# EAGLE design Palette PCB (EAGLE 7.6.0)
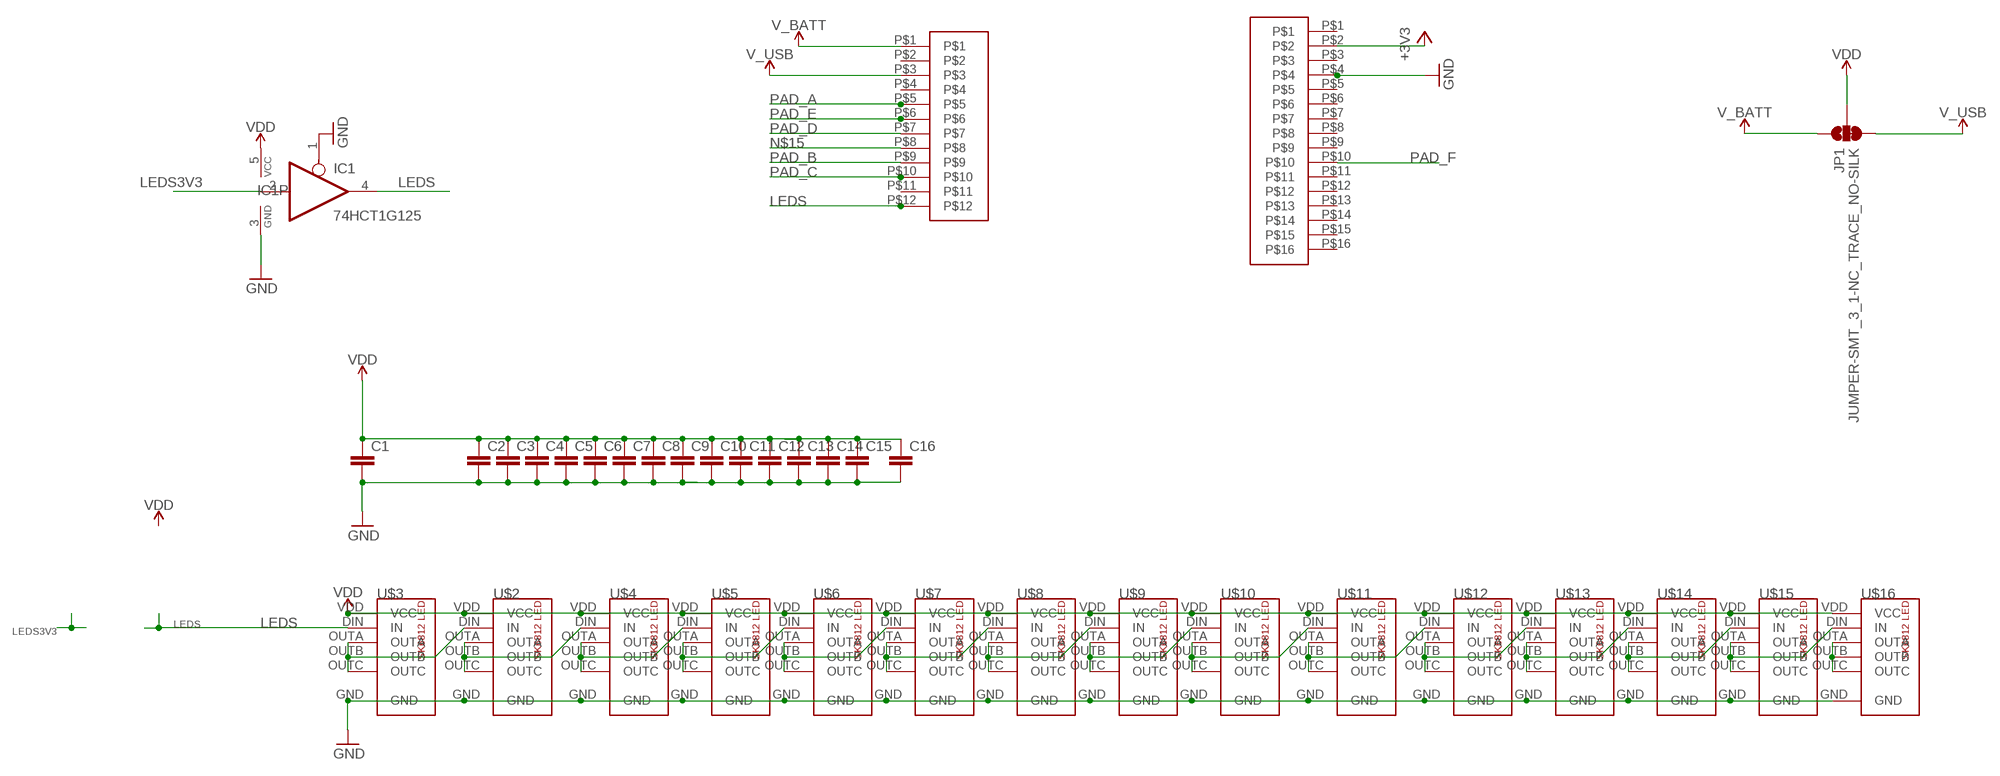
[diagram p0: schematic, sheet 1]

## Parts
C1  C-EUC0402K  [C0402K]
C2  C-EUC0402K  [C0402K]
C3  C-EUC0402K  [C0402K]
C4  C-EUC0402K  [C0402K]
C5  C-EUC0402K  [C0402K]
C6  C-EUC0402K  [C0402K]
C7  C-EUC0402K  [C0402K]
C8  C-EUC0402K  [C0402K]
C9  C-EUC0402K  [C0402K]
C10  C-EUC0402K  [C0402K]
C11  C-EUC0402K  [C0402K]
C12  C-EUC0402K  [C0402K]
C13  C-EUC0402K  [C0402K]
C14  C-EUC0402K  [C0402K]
C15  C-EUC0402K  [C0402K]
C16  C-EUC0805K  [C0805K]
IC1  74HCT1G125  74AHC1G125DBV  [SOT23-5]
JP1  JUMPER-SMT_3_1-NC_TRACE_NO-SILK  [SMT-JUMPER_3_1-NC_TRACE_NO-SILK]
U$2  SK6812OK  [SK6812_V2C]
U$3  SK6812OK  [SK6812_V2C]
U$4  SK6812OK  [SK6812_V2C]
U$5  SK6812OK  [SK6812_V2C]
U$6  SK6812OK  [SK6812_V2C]
U$7  SK6812OK  [SK6812_V2C]
U$8  SK6812OK  [SK6812_V2C]
U$9  SK6812OK  [SK6812_V2C]
U$10  SK6812OK  [SK6812_V2C]
U$11  SK6812OK  [SK6812_V2C]
U$12  SK6812OK  [SK6812_V2C]
U$13  SK6812OK  [SK6812_V2C]
U$14  SK6812OK  [SK6812_V2C]
U$15  SK6812OK  [SK6812_V2C]
U$16  SK6812OK  [SK6812_V2C]
U$17  SMD-FEMALE-HEADER-16  [SMD-FEMALE-HEADER-16]
U$18  SMD-FEMALE-HEADER-12  [SMD-FEMALE-HEADER-12]

## Nets
+3V3: U$17.P$2
GND: C1.2 C2.2 C3.2 C4.2 C5.2 C6.2 C7.2 C8.2 C9.2 C10.2 C11.2 C12.2 C13.2 C14.2 C15.2 C16.2 IC1.1(OE) IC1.3(GND) U$2.GND U$3.GND U$4.GND U$5.GND U$6.GND U$7.GND U$8.GND U$9.GND U$10.GND U$11.GND U$12.GND U$13.GND U$14.GND U$15.GND U$16.GND U$17.P$4
LEDS: IC1.4(O) U$3.DIN(IN) U$18.P$12
LEDS3V3: IC1.2(I)
N$2: U$2.DIN(IN) U$3.OUTA U$3.OUTB U$3.OUTC
N$3: U$2.OUTA U$2.OUTB U$2.OUTC U$4.DIN(IN)
N$4: U$4.OUTA U$4.OUTB U$4.OUTC U$5.DIN(IN)
N$5: U$5.OUTA U$5.OUTB U$5.OUTC U$6.DIN(IN)
N$6: U$6.OUTA U$6.OUTB U$6.OUTC U$7.DIN(IN)
N$7: U$7.OUTA U$7.OUTB U$7.OUTC U$8.DIN(IN)
N$8: U$8.OUTA U$8.OUTB U$8.OUTC U$9.DIN(IN)
N$9: U$9.OUTA U$9.OUTB U$9.OUTC U$10.DIN(IN)
N$10: U$10.OUTA U$10.OUTB U$10.OUTC U$11.DIN(IN)
N$11: U$11.OUTA U$11.OUTB U$11.OUTC U$12.DIN(IN)
N$12: U$12.OUTA U$12.OUTB U$12.OUTC U$13.DIN(IN)
N$13: U$13.OUTA U$13.OUTB U$13.OUTC U$14.DIN(IN)
N$14: U$14.OUTA U$14.OUTB U$14.OUTC U$15.DIN(IN)
N$15: U$18.P$8
N$16: U$15.OUTA U$15.OUTB U$15.OUTC U$16.DIN(IN)
N$18: U$16.OUTA U$16.OUTB U$16.OUTC
PAD_A: U$18.P$5
PAD_B: U$18.P$9
PAD_C: U$18.P$10
PAD_D: U$18.P$7
PAD_E: U$18.P$6
PAD_F: U$17.P$10
V_BATT: JP1.1 U$18.P$1
V_USB: JP1.3 U$18.P$3
VDD: C1.1 C2.1 C3.1 C4.1 C5.1 C6.1 C7.1 C8.1 C9.1 C10.1 C11.1 C12.1 C13.1 C14.1 C15.1 C16.1 IC1.5(VCC) JP1.2 U$2.VDD(VCC) U$3.VDD(VCC) U$4.VDD(VCC) U$5.VDD(VCC) U$6.VDD(VCC) U$7.VDD(VCC) U$8.VDD(VCC) U$9.VDD(VCC) U$10.VDD(VCC) U$11.VDD(VCC) U$12.VDD(VCC) U$13.VDD(VCC) U$14.VDD(VCC) U$15.VDD(VCC) U$16.VDD(VCC)
Unconnected: U$17.P$1 U$17.P$3 U$17.P$5 U$17.P$6 U$17.P$7 U$17.P$8 U$17.P$9 U$17.P$11 U$17.P$12 U$17.P$13 U$17.P$14 U$17.P$15 U$17.P$16 U$18.P$2 U$18.P$4 U$18.P$11

## Library data of the parts
C1-C16 = rcl:C-EU: CAPACITOR, European symbol
IC1 = 74xx-little-us:74*1G125: Single Bus Buffer Gate with 3-State Output
JP1 = SparkFun-Jumpers:JUMPER-SMT_3_1-NC_TRACE: Normally closed trace jumper (1 of 2 connections) This jumper has a trace between two pads so it's normally closed (NC). The other connection is normally open (NO). Use a razor knife to open the connection. For best results follow the IPC guidelines for cutting traces: Cutout at least 0.063 mm (0.005 in). Remove all loose material to clean up the cut area. Seal the cut with an approved epoxy. Reapply solder to reclose the connection, or to close the NO connection.
U$2-U$16 = Palette Eagle library:SK6812
U$17 = Palette Eagle library:SMD-FEMALE-HEADER-16
U$18 = Palette Eagle library:SMD-FEMALE-HEADER-12

## Net classes
3 VCC: width 0.254 mm, drill 0.406 mm, clearance 0.127 mm

## Board
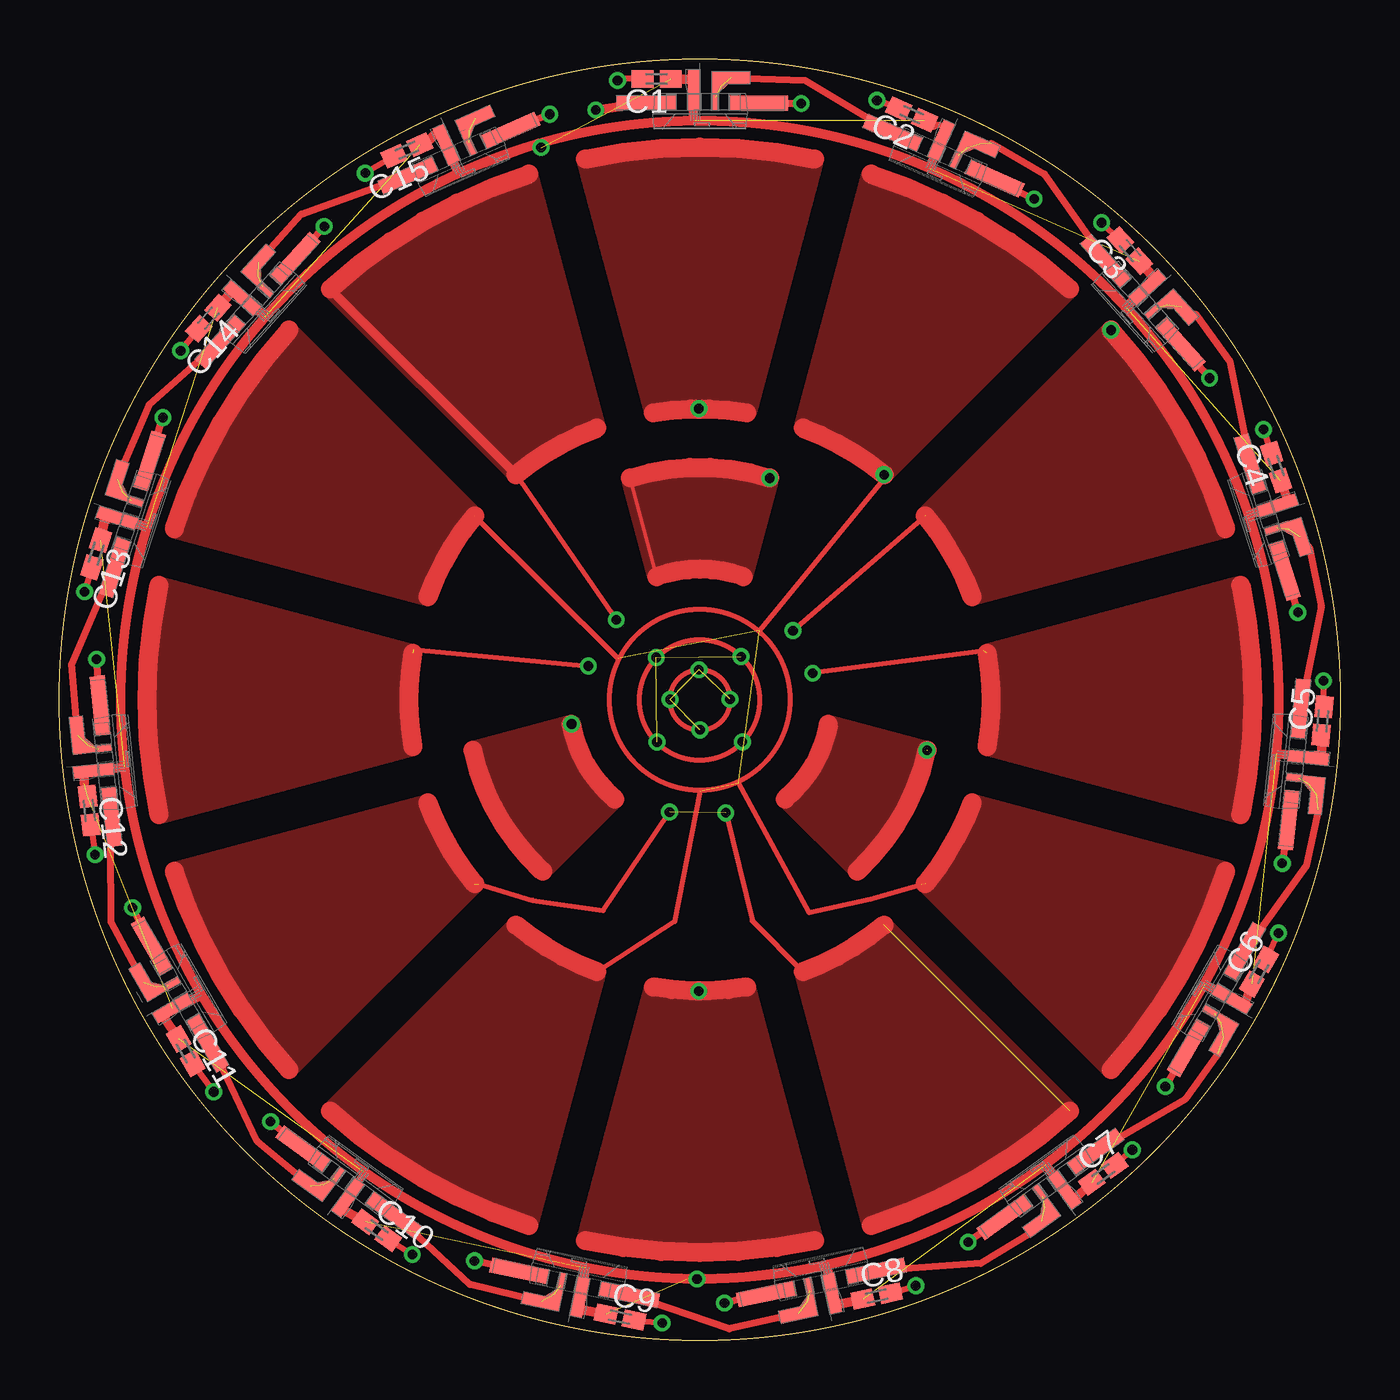
[diagram p1: board, top side]
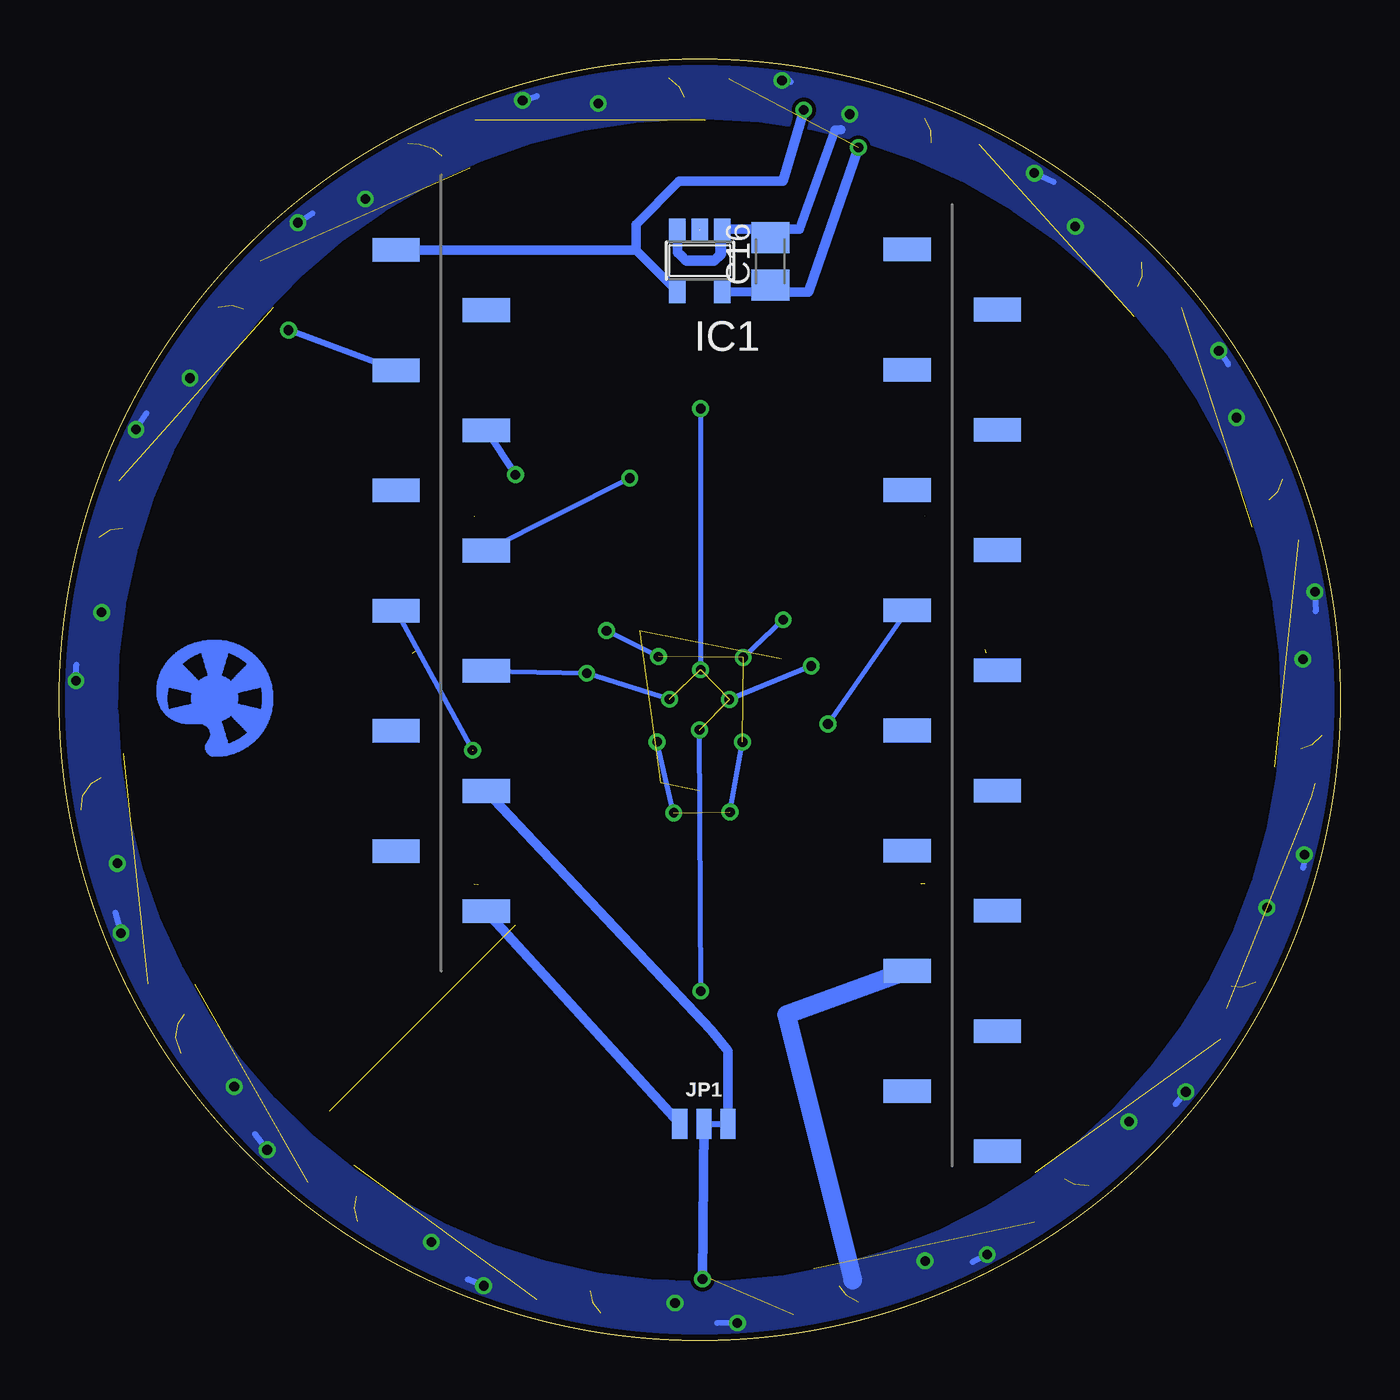
[diagram p2: board, bottom side, seen from below]

Size 54.14 x 54.14 mm. Coordinates in mm from the lower left corner, seen from the top.
Outline: circle at 27.07,27.07 radius 27.07
Copper layers (1*16): Top 0.035mm / dielectric 1.5mm / Bottom 0.035mm
Design rules "SeeedStudio_2layer_DRU_no_angle_20140221": minimum track width 6mil, minimum drill 12mil, track to track 6mil, track to pad 6mil, pad to pad 6mil, via to via 6mil, smd to smd 0mil, copper to edge 10mil, drill to drill 10mil, minimum pad ring 10mil, minimum via ring 6mil, stop-mask expansion 2mil, vias tented up to drill 100mil, thermal gap 10mil

### Footprints (pad centres in the part's own frame; a part is rotated, then mirrored left to right if it is on the bottom)
C0402K = smd 0.925 x 0.74: 1 -0.6,0; 2 0.6,0
C0805K = smd 1.3 x 1.6: 1 -1,0; 2 1,0
SOT23-5 = smd 0.69 x 0.99: 1 -0.95,-1.29; 2 0,-1.29; 3 0.95,-1.29; 4 0.95,1.3; 5 -0.95,1.3
SMT-JUMPER_3_1-NC_TRACE_NO-SILK = smd 0.635 x 1.27: 1 -1.016,0; 2 0,0; 3 1.016,0
SK6812_V2C = smd 2.5 x 0.635: DIN -2.295,1.271; GND 2.446,1.254 | smd 0.3 x 1.1: OUTA 0.633,1.508 | smd 0.6 x 0.3 rotated 45: OUTB 0.842,1.951 | smd 1.6 x 0.55: OUTC 1.291,2.334 | smd 0.5 x 1.7: VDD -0.278,1.811
SMD-FEMALE-HEADER-16 = smd 1 x 2: P$1 -2.54,-1.27; P$2 0,2.54; P$3 2.54,-1.27; P$4 5.08,2.54; P$5 7.62,-1.27; P$6 10.16,2.54; P$7 12.7,-1.27; P$8 15.24,2.54; P$9 17.78,-1.27; P$10 20.32,2.54; P$11 22.86,-1.27; P$12 25.4,2.54; P$13 27.94,-1.27; P$14 30.48,2.54; P$15 33.02,-1.27; P$16 35.56,2.54
SMD-FEMALE-HEADER-12 = smd 1 x 2: P$1 -2.54,-1.27; P$2 0,2.54; P$3 2.54,-1.27; P$4 5.08,2.54; P$5 7.62,-1.27; P$6 10.16,2.54; P$7 12.7,-1.27; P$8 15.24,2.54; P$9 17.78,-1.27; P$10 20.32,2.54; P$11 22.86,-1.27; P$12 25.4,2.54

### Placement (x,y rotation side)
C1  25.24,53.3 180 top
C2  36.02,51.79 156 top
C3  45.24,46.04 132 top
C4  51.42,36.9 108 top
C5  53.38,26.17 84 top
C6  50.7,15.58 60 top
C7  44.12,7.03 36 top
C8  34.54,1.87 12 top
C9  23.7,0.98 348 top
C10  13.42,4.65 324 top
C11  5.35,12.22 300 top
C12  1.27,22.38 276 top
C13  1.57,33.24 252 top
C14  6.3,43.19 228 top
C15  14.69,50.29 204 top
C16  24.08,45.59 90 bottom
IC1  27.06,45.62 180 bottom
JP1  26.9,9.14 0 bottom
U$2  36.78,48.94 336 top
U$3  27.09,51.02 0 top
U$4  44.81,43.06 312 top
U$5  49.83,34.46 288 top
U$6  50.95,24.55 264 top
U$7  47.85,15.1 240 top
U$8  41.19,7.67 216 top
U$9  32.01,3.7 192 top
U$10  22.12,3.65 168 top
U$11  13.04,7.67 144 top
U$12  6.23,15.18 120 top
U$13  3.24,24.53 96 top
U$14  4.26,34.45 72 top
U$15  9.27,43.04 48 top
U$16  17.34,48.98 24 top
U$17  15.76,10.53 90 bottom
U$18  37.36,20.67 90 bottom

### Tracks (layer width: path | path; a pad name or v marks a point on that pad's centre or on a via)
GND  (via drill 0.41)
  Top 0.254: C1.2 23.66,53.3 v23.59,53.23 | C2.2 v34.55,52.4 | C3.2 v44.05,47.23 | C4.2 v50.89,38.49 | C5.2 v53.42,27.87 | C6.2 v51.52,17.21 | C7.2 v45.35,8.05 | C8.2 v36.2,2.3 | C9.2 v25.48,0.73 | C10.2 v14.93,3.62 | C11.2 v6.53,10.5 | C12.2 v1.52,20.52 | C13.2 v1.07,31.63 | C14.2 v5.13,41.81 | C15.2 v12.94,49.32
  Top 0.305: U$3.GND v31.35,52.26 | U$2.GND v41.2,48.23 | U$4.GND v48.61,40.66 | U$5.GND v52.34,30.76 | U$6.GND v51.68,20.16 | U$7.GND v46.74,10.72 | U$8.GND v38.41,4.16 | U$9.GND v28.11,1.58 | U$10.GND v17.55,3.36 | U$11.GND v8.93,9.24 | U$12.GND v3.1,18.28 | U$13.GND v1.58,28.78 | U$14.GND v4.38,38.99 | U$15.GND v11.2,47.07 | U$16.GND v20.73,51.81
  Bottom 0.254: v23.59,53.23 23.27,53.23 23.21,53.18 | v34.55,52.4 33.95,52.57 | v44.05,47.23 43.44,47.62 | v50.89,38.49 50.44,39.18 | v53.42,27.87 53.41,28.56 | v51.52,17.21 51.75,18.07 | v45.35,8.05 45.86,8.71 | v36.2,2.3 36.87,2.58 | v25.48,0.73 26.32,0.72 | v14.93,3.62 15.54,3.32 | v6.53,10.5 6.97,9.97 | v1.52,20.52 1.58,19.97 | v1.07,31.63 1.05,30.81 | v5.13,41.81 4.74,41.24 | v12.94,49.32 12.11,48.94
  Bottom 0.406: IC1.3 28.01,45.98 27.63,45.6 26.46,45.6 26.15,45.9 26.15,46.87 IC1.1 | IC1.3 28.01,45.97 27.91,45.87 27.89,45.87 27.64,45.63 27.08,45.63 27.05,45.6 | IC1.3 28.01,45.96 27.69,45.64 26.46,45.64 26.2,45.9 26.2,46.6 26,46.81 26,46.95 24.18,46.95 | 24.18,46.95 22.86,46.95 21.35,51.14 21.11,51.15 | C16.2 24.18,46.95
  Bottom 0.813: U$17.P$4 23.4,13.76 20.6,2.55
  pour Bottom: -0.99,27.15 -0.97,27.17 arc-90 27.01,54.8 27.19,54.86 arc-90 54.86,26.18 arc-90 27.22,-0.76 27.2,-0.77 arc-90
LEDS  (via drill 0.41)
  Top 0.406: U$3.DIN v22.67,51.99
  Bottom 0.406: U$18.P$12 29.76,46.07 | 29.76,46.07 IC1.4 | 29.76,46.07 29.76,46.08 29.76,47.15 27.94,48.97 25.79,48.97 23.55,48.99 v22.67,51.99
N$2  (2 unrouted)
  Top 0.305: U$3.OUTC 31.52,53.24 U$2.DIN
N$3  (3 unrouted)
  Top 0.305: 39.38,50.58 41.63,49.28 U$4.DIN
N$4  (2 unrouted)
  Top 0.305: U$4.OUTC 48.03,43.35 49.47,41.36 U$5.DIN
N$5  (2 unrouted)
  Top 0.305: U$5.OUTC 52.82,33.51 53.33,31.01 U$6.DIN
N$6  (3 unrouted)
  Top 0.305: 53.2,22.4 52.71,20.06 U$7.DIN
N$7  (3 unrouted)
  Top 0.305: 48.98,12.12 47.58,10.19 U$8.DIN
N$8  (2 unrouted)
  Top 0.305: U$8.OUTC 41.04,4.51 38.94,3.25 U$9.DIN
N$9  (2 unrouted)
  Top 0.305: U$9.OUTC 28.3,0.48 U$10.DIN
N$10  (2 unrouted)
  Top 0.305: U$10.OUTC 17.35,2.36 14.92,4.62 U$11.DIN
N$11  (2 unrouted)
  Top 0.305: U$11.OUTC 8.37,8.41 6.91,11.49 U$12.DIN
N$12  (2 unrouted)
  Top 0.305: U$12.OUTC 2.19,17.67 2.18,20.92 U$13.DIN
N$13  (2 unrouted)
  Top 0.305: U$13.OUTC 0.53,28.57 1.8,31.53 U$14.DIN
N$14  (2 unrouted)
  Top 0.305: U$14.OUTC 3.79,39.53 U$15.DIN
N$16  (2 unrouted)
  Top 0.305: U$15.OUTC 10.23,47.59 U$16.DIN
N$18  (2 unrouted)
N$31
  cutout Bottom: 2.58,26.14 2.56,26.72 arc-90 26.84,51.54 27.47,51.53 arc-90 51.6,26.69 51.58,26.66 arc-90 26.86,2.57 28.05,2.58 arc-90
PAD_A  (via drill 0.41)  (5 unrouted)
  Top 0.203: 14.99,29.18 v22.36,28.5 | 39.07,29.13 v31.84,28.19
  Top 0.813: 22.23,49.91 arc-24 31.93,49.91 | 25.1,39.19 arc-19 29.05,39.19 | 49.93,31.91 arc-24 49.93,22.21 | 39.21,29.04 arc-19 39.21,25.09 | 31.93,4.21 arc-24 22.23,4.21 | 29.05,14.93 arc-19 25.1,14.93 | 4.22,22.21 arc-24 4.22,31.91 | 14.95,25.09 arc-19 14.95,29.04
  Bottom 0.203: v27.02,14.76 v27.08,25.79 | v22.36,28.5 v25.82,27.08 | v27.03,39.37 v27.03,28.34 | v28.35,27.09 v31.84,28.19 U$18.P$5
  pour Top: 22.05,49.87 26.73,50.61 32.13,49.89 29.26,39.17 27.04,39.57 24.94,39.1
  pour Top: 39.16,29.24 39.51,27.15 39.16,24.89 49.91,22.01 50.58,27.2 49.91,32.12
  pour Top: 32.12,4.22 26.95,3.56 22.04,4.24 24.92,14.98 27.03,14.63 29.24,14.96
  pour Top: 4.24,32.09 14.98,29.22 14.59,27.07 15.03,24.9 4.26,22.02 3.53,27.16
PAD_B  (via drill 0.41)  (5 unrouted)
  Top 0.203: 28.7,23.54 31.69,18.07 34.28,18.65 36.44,19.27 | 17.56,34.84 23.61,28.81 | 34.86,36.44 29.59,29.99 | 27.07,23.22 26,17.69 22.72,15.57
  Top 0.305: v34.85,36.58 34.27,37.21
  Top 0.406: v34.85,36.58 34.86,36.44
  Top 0.813: 34.31,49.28 arc-24 42.7,44.43 | 31.43,38.55 arc-19 v34.85,36.58 | 49.29,19.83 arc-24 44.44,11.44 | 38.57,22.71 arc-19 36.6,19.29 | 19.85,4.85 arc-24 11.45,9.69 | 22.72,15.57 arc-19 19.3,17.54 | 4.86,34.29 arc-24 9.71,42.69 | 15.58,31.42 arc-19 17.56,34.84
  Bottom 0.305: U$18.P$9 v34.85,36.58
  pour Top: 31.24,38.61 33.22,37.9 35,36.44 42.86,44.29 39.03,47.33 34.12,49.36
  pour Top: 38.61,22.9 37.94,21.01 36.47,19.14 44.34,11.27 47.4,15.31 49.34,20.02
  pour Top: 20.03,4.77 15.45,6.63 11.32,9.81 19.18,17.67 20.77,16.33 22.91,15.52
  pour Top: 4.8,34.09 15.53,31.22 16.35,33.46 17.69,34.98 9.83,42.84 6.86,39.14
PAD_C  (via drill 0.41)  (6 unrouted)
  Top 0.203: 17.73,19.29 20.01,18.59 22.99,18.16 v25.79,22.32 | 19.3,36.58 v23.54,30.45 | v31.01,29.99 36.57,34.82 | v28.17,22.29 29.29,17.72 31.43,15.57
  Top 0.406: 19.3,36.58 11.45,44.43
  Top 0.813: v44.44,42.69 arc-24 49.29,34.29 | 36.6,34.84 arc-19 38.57,31.42 | 42.7,9.69 arc-24 34.3,4.85 | 34.85,17.54 arc-19 31.43,15.57 | 9.71,11.44 arc-24 4.86,19.83 | 17.56,19.29 arc-19 15.58,22.71 | 11.45,44.43 arc-24 19.85,49.28 | 19.3,36.58 arc-19 22.72,38.55
  Bottom 0.203: v31.01,29.99 v28.81,28.89 | v28.17,22.29 v28.87,25.29 | v25.79,22.32 v25.26,25.28 | v23.54,30.45 v25.23,28.85
  Bottom 0.254: U$18.P$10 v44.44,42.69
  pour Top: 36.44,34.98 37.83,33.34 38.61,31.23 49.37,34.11 47.65,38.41 44.32,42.85
  pour Top: 34.98,17.68 33.35,16.33 31.25,15.52 34.13,4.78 38.92,6.77 42.85,9.82
  pour Top: 4.79,20 6.56,15.52 9.85,11.3 17.72,19.16 16.3,20.8 15.53,22.88
  pour Top: 19.19,36.44 11.31,44.31 15.3,47.45 20.03,49.34 22.9,38.61 20.76,37.87
PAD_D  (via drill 0.41)
  Top 0.152: 25.25,32.27 24.13,36.44
  Top 0.813: 24.13,36.44 arc-35 v30.02,36.44 | 28.91,32.27 arc39 25.25,32.27
  Bottom 0.203: v30.02,36.44 U$18.P$7
  pour Top: 23.94,36.4 25.05,32.23 27.04,32.78 29.1,32.21 30.22,36.4 27.18,37.09
PAD_E  (via drill 0.41)  (1 unrouted)
  Top 0.152: 33.72,19.82
  Top 0.813: 33.72,19.82 arc35 v36.67,24.93 | 32.51,26.04 arc-39 30.67,22.87
  Bottom 0.203: U$18.P$6 v36.67,24.94
  pour Top: 36.72,25.12 32.53,26.24 31.94,24.27 30.53,22.76 33.59,19.7 35.66,22.12
PAD_F  (via drill 0.41)
  Top 0.203: v21.65,26.04 21.93,25.32
  Top 0.813: 20.43,19.82 arc-35 17.49,24.93 | 23.48,22.87 arc-39 v21.65,26.04
  Bottom 0.203: U$17.P$10 v21.65,26.04
  pour Top: 20.57,19.68 23.64,22.74 22.15,24.23 21.59,26.23 17.4,25.11 18.42,22.08
V_BATT
  Bottom 0.406: U$18.P$1 JP1.1
V_USB
  Bottom 0.406: U$18.P$3 26.58,13.12 25.88,12.23 JP1.3
VDD  (via drill 0.41)  (16 unrouted)
  Top 0.254: U$2.VDD 37.27,51.02 37.45,51.2 37.39,51.2 37.26,51.34 36.93,51.34 36.78,51.34 | 46.38,44.88 46.33,44.83 U$4.VDD | U$5.VDD 51.98,35.35 52.05,35.36 | U$6.VDD 53.23,24.73 | U$7.VDD 50.03,14.18 50.08,14.16 | U$8.VDD 42.83,5.97 42.86,5.93 | U$9.VDD 32.74,1.48 32.76,1.33 | U$10.VDD 21.93,1.39 | 11.97,5.53 U$11.VDD | U$12.VDD 4.46,13.85 | U$13.VDD 1.1,23.9 | 1.92,34.72 1.9,34.72 | U$15.VDD 7.38,44.4 7.33,44.45 | U$16.VDD 16.13,50.87
  Top 0.305: U$11.VDD 12.89,7.09
  Top 0.406: 22.24,3.04 U$10.VDD 21.97,1.3 | 6.01,14.58 U$12.VDD 4.39,13.7 C11.1 | 2.76,24.23 U$13.VDD 1.03,24.03 1.05,23.53 | 3.71,34.37 U$14.VDD 1.92,34.72 C13.1 | U$15.VDD 8.7,43.25 | U$2.VDD 36.77,49.54 | U$4.VDD 45.08,43.66 | U$5.VDD 50.26,34.9 | 51.44,24.79 U$6.VDD 53.34,24.76 C5.1 | U$7.VDD 48.41,15.05 | U$8.VDD 41.7,7.41 | U$9.VDD 32.44,3.13 31.29,2.96 28.65,2.65 v26.95,2.59 26.6,2.59 | 25.84,53.29 26.8,53.29 26.8,52.84 U$3.VDD 26.81,51.57 26.83,51.55 | 53.23,24.73 53.27,24.59 | 21.96,1.19 21.97,1.3 | C8.1 32.74,1.48 | C9.1 21.97,1.3 | C10.1 11.97,5.53 | C14.1 7.38,44.4 | C15.1 15.4,50.51 15.84,50.93 16.09,51 U$16.VDD 16.86,49.34 20.25,50.59 v20.36,50.4 | C2.1 36.93,51.34 | C3.1 46.33,44.83 | C4.1 51.98,35.35 | C6.1 50.08,14.16 | C7.1 42.86,5.93
  Bottom 0.406: v26.95,2.59 JP1.2 | IC1.5 24.06,44.3 | 24.06,44.3 22.47,44.29 v20.36,50.4 | C16.1 24.06,44.3
(copper drawn outside any net)
  shapes: Bottom area x613, Top circle x4